# EAGLE schematic CCM_0018 (EAGLE 9.0.1)
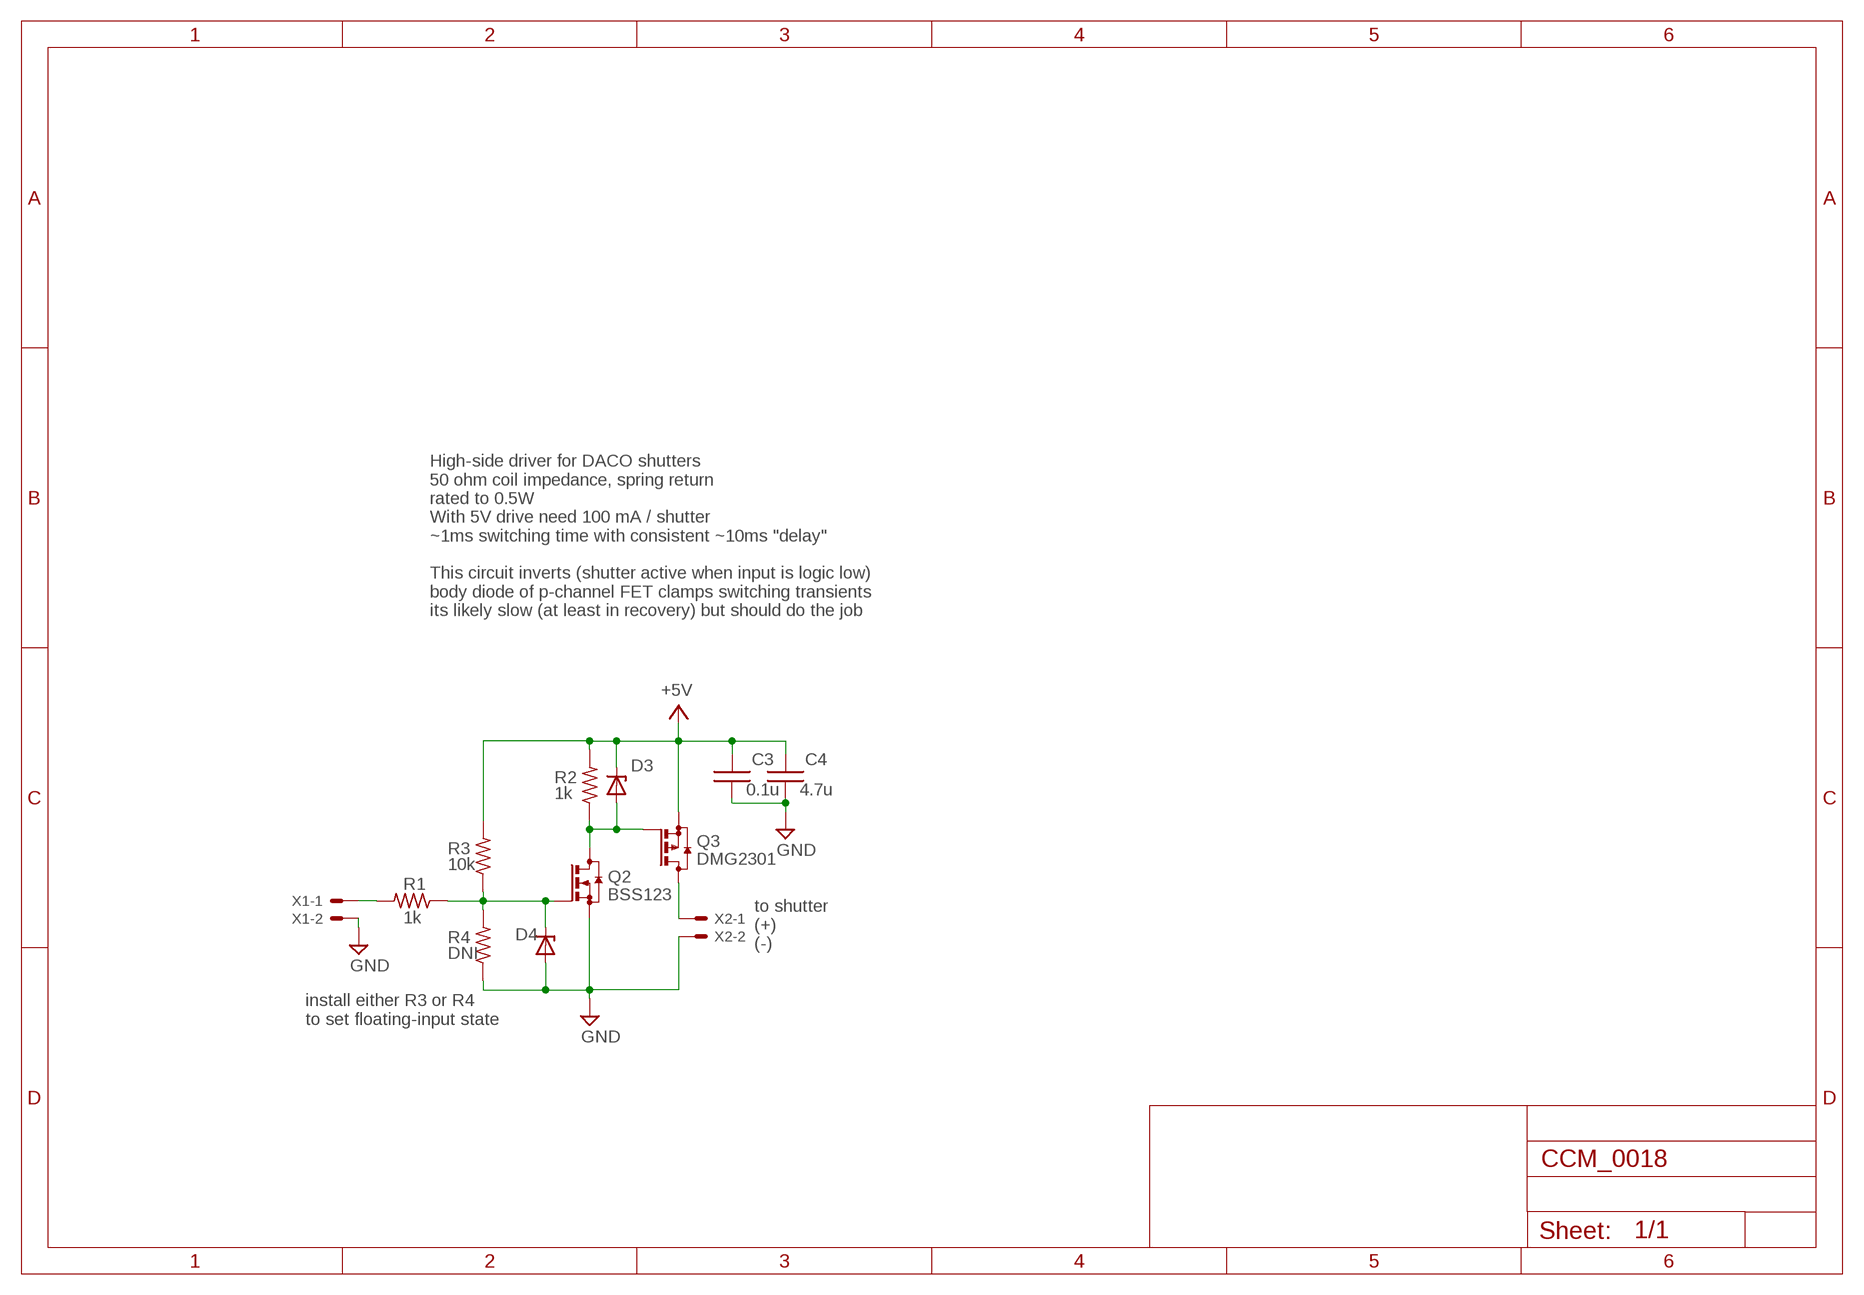
[diagram p0: schematic, sheet 1]

## Parts
C3  0.1u  CAPACITOR0603  [0603]
C4  4.7u  CAPACITOR0603  [0603]
D3  ZENER-DIODESOT23  [SOT23]
D4  ZENER-DIODESOT23  [SOT23]
Q2  BSS123  [SOT23]
Q3  DMG2301  BSS84  [SOT23]
R1  1k  RESISTOR0603  [0603]
R2  1k  RESISTOR0603  [0603]
R3  10k  RESISTOR0603  [0603]
R4  DNI  RESISTOR0603  [0603]
X1  22-23-2021  [22-23-2021]
X2  22-23-2021  [22-23-2021]

## Nets
+5V: C3.1 C4.1 D3.3(C) Q3.2(S) R2.2 R3.2
GND: C3.2 C4.2 D4.1(A) Q2.2(S) R4.1 X1.2 X2.2
N$1: D4.3(C) Q2.1(G) R1.1 R3.1 R4.2
N$2: D3.1(A) Q2.3(D) Q3.1(G) R2.1
N$3: Q3.3(D) X2.1
N$5: R1.2 X1.1

## Notes on the sheet
- High-side driver for DACO shutters 
  50 ohm coil impedance, spring return
  rated to 0.5W
  With 5V drive need 100 mA / shutter
  ~1ms switching time with consistent ~10ms "delay"
  
  This circuit inverts (shutter active when input is logic low)
  body diode of p-channel FET clamps switching transients
  its likely slow (at least in recovery) but should do the job
- to shutter
  (+)
  (-)
- install either R3 or R4
  to set floating-input state

## Library data of the parts
C3 C4 = noah:CAPACITOR
D3 D4 = diode:ZENER-DIODE: Z-Diode
Q2 = transistor-small-signal:BSS123: N-CHANNEL MOS FET
Q3 = transistor-small-signal:BSS84: P-CHANNEL MOS FET
R1-R4 = noah:RESISTOR: RESISTOR, American symbol
X1 X2 = con-molex:22-23-2021: .100" (2.54mm) Center Header - 2 Pin; MF: MOLEX; MPN: 22-23-2021; OC_FARNELL: 1462926; OC_NEWARK: 25C3832

## Net classes
1 standard: width 0.61 mm, clearance 0.254 mm